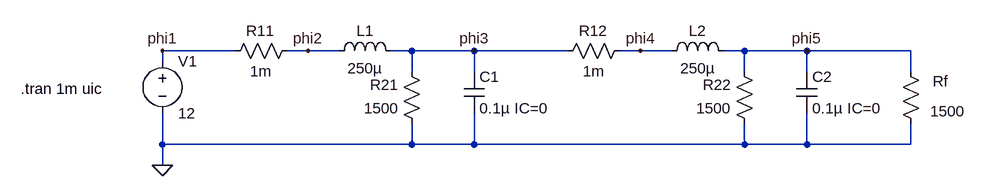
[diagram p0: schematic koaxialKabel2.asc]
koaxialKabel2.asc, the LTspice schematic file:
Version 4
SHEET 1 1496 680
WIRE 128 96 16 96
WIRE 240 96 208 96
WIRE 288 96 240 96
WIRE 400 96 368 96
WIRE 496 96 400 96
WIRE 640 96 496 96
WIRE 752 96 720 96
WIRE 800 96 752 96
WIRE 912 96 880 96
WIRE 1008 96 912 96
WIRE 1168 96 1008 96
WIRE 16 112 16 96
WIRE 400 128 400 96
WIRE 496 128 496 96
WIRE 912 128 912 96
WIRE 1008 128 1008 96
WIRE 1168 128 1168 96
WIRE 16 240 16 192
WIRE 400 240 400 208
WIRE 400 240 16 240
WIRE 496 240 496 192
WIRE 496 240 400 240
WIRE 912 240 912 208
WIRE 912 240 496 240
WIRE 1008 240 1008 192
WIRE 1008 240 912 240
WIRE 1168 240 1168 208
WIRE 1168 240 1008 240
WIRE 16 272 16 240
FLAG 16 272 0
FLAG 16 96 phi1
FLAG 240 96 phi2
FLAG 496 96 phi3
FLAG 752 96 phi4
FLAG 1008 96 phi5
SYMBOL res 112 112 R270
WINDOW 0 31 55 VTop 2
WINDOW 3 0 56 VBottom 2
SYMATTR InstName R11
SYMATTR Value 1m
SYMBOL ind 272 112 R270
WINDOW 0 31 56 VTop 2
WINDOW 3 5 56 VBottom 2
SYMATTR InstName L1
SYMATTR Value 250µ
SYMBOL res 416 224 R180
WINDOW 0 36 76 Left 2
WINDOW 3 36 40 Left 2
SYMATTR InstName R21
SYMATTR Value 1500
SYMBOL res 1184 224 R180
WINDOW 0 -42 81 Left 2
WINDOW 3 -68 35 Left 2
SYMATTR InstName Rf
SYMATTR Value 1500
SYMBOL cap 480 128 R0
SYMATTR InstName C1
SYMATTR Value 0.1µ IC=0
SYMBOL voltage 16 96 R0
WINDOW 123 0 0 Left 0
WINDOW 39 0 0 Left 0
SYMATTR InstName V1
SYMATTR Value 12
SYMBOL res 624 112 R270
WINDOW 0 31 55 VTop 2
WINDOW 3 0 56 VBottom 2
SYMATTR InstName R12
SYMATTR Value 1m
SYMBOL ind 784 112 R270
WINDOW 0 31 56 VTop 2
WINDOW 3 5 56 VBottom 2
SYMATTR InstName L2
SYMATTR Value 250µ
SYMBOL res 928 224 R180
WINDOW 0 36 76 Left 2
WINDOW 3 36 40 Left 2
SYMATTR InstName R22
SYMATTR Value 1500
SYMBOL cap 992 128 R0
SYMATTR InstName C2
SYMATTR Value 0.1µ IC=0
TEXT -202 154 Left 2 !.tran 1m uic

The netlist it stands for:
* koaxialKabel2.asc
R11 phi1 phi2 1m
L1 phi2 phi3 250µ
R21 0 phi3 1500
Rf 0 phi5 1500
C1 phi3 0 0.1µ IC=0
V1 phi1 0 12
R12 phi3 phi4 1m
L2 phi4 phi5 250µ
R22 0 phi5 1500
C2 phi5 0 0.1µ IC=0
.tran 1m uic
.backanno
.end